# Altium schematic sheet ESP32_MCU.SchDoc: ESP32-WROOM32D Module
size A4; DocumentNumber: 2; SheetNumber: 2; SheetTotal: 31
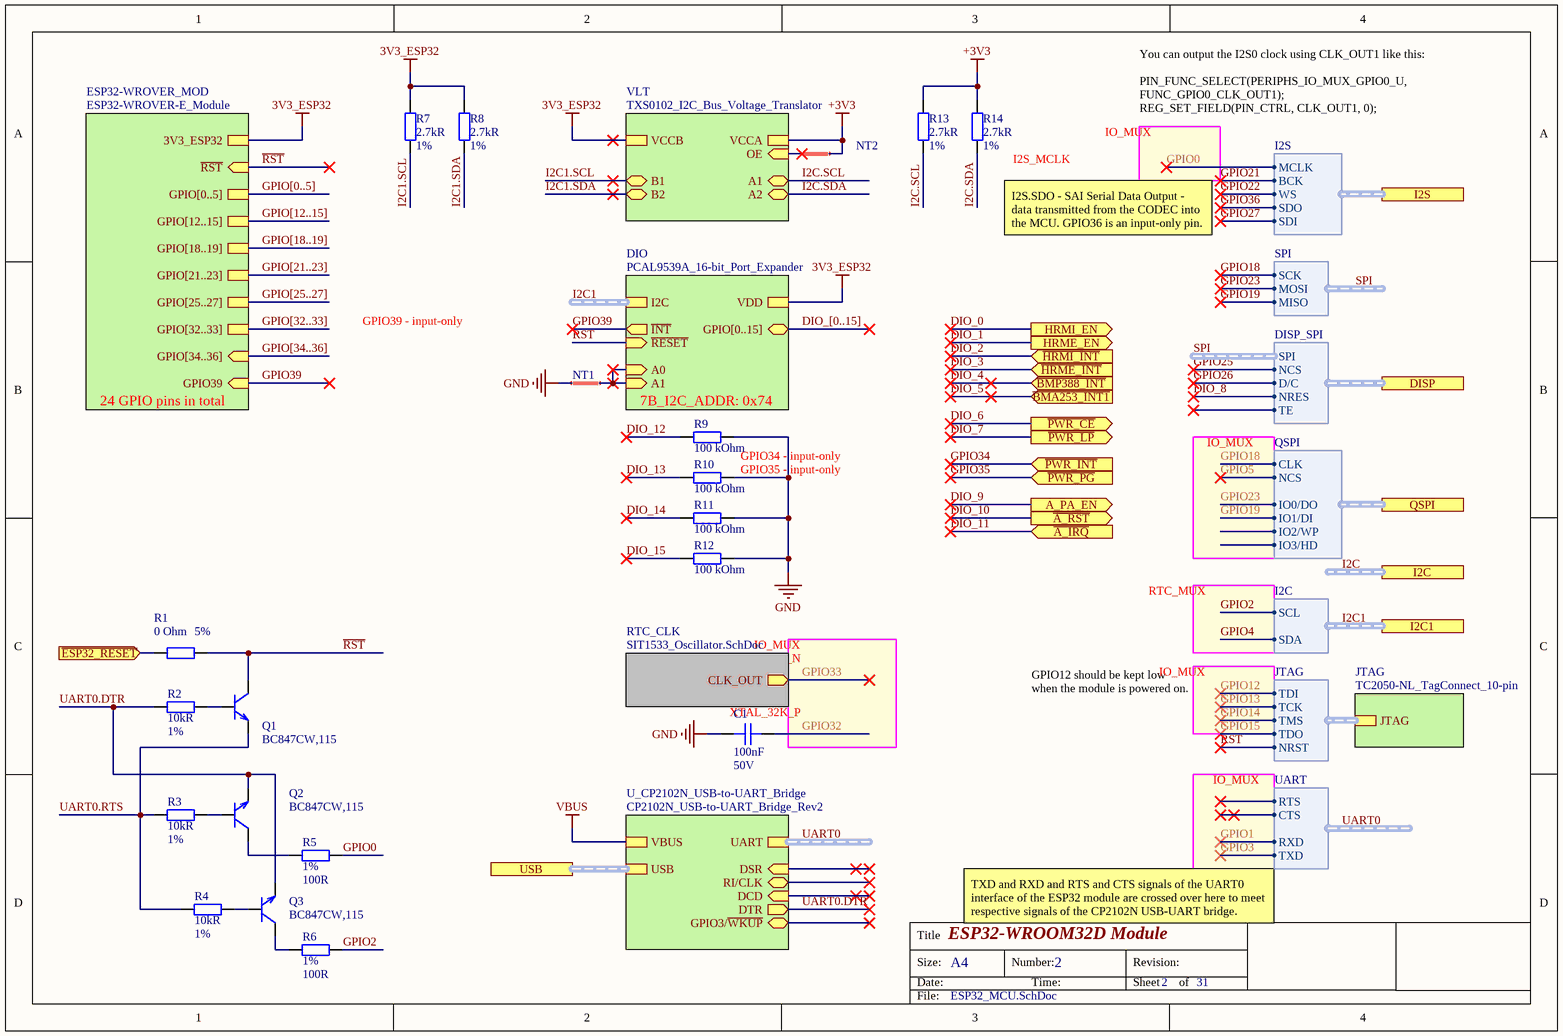
[diagram p0: ESP32_MCU.SchDoc]

## Parts
C1  Capacitance: 100nF  Voltage: 50V  [C0402]  (hidden comment: CAP CER 0.1UF 50V X7R 0402)
NT1  Net Tie  [Net Tie 6x30mil]  (value not drawn)  (net tie, no BOM)
NT2  Net Tie  [Net Tie 6x30mil]  (value not drawn)  (net tie, no BOM)
Q1  BC847CW,115  [SOT-323]
Q2  BC847CW,115  [SOT-323]
Q3  BC847CW,115  [SOT-323]
R1  Tolerance: 5%  Resistance: 0 Ohm  [R0402]  (hidden comment: RES SMD 0 OHM JUMPER 1/16W 0402)
R2  Resistance: 10kR  Tolerance: 1%  [R0402]  (hidden comment: RES SMD 10K OHM 1% 1/16W 0402)
R3  Resistance: 10kR  Tolerance: 1%  [R0402]  (hidden comment: RES SMD 10K OHM 1% 1/16W 0402)
R4  Resistance: 10kR  Tolerance: 1%  [R0402]  (hidden comment: RES SMD 10K OHM 1% 1/16W 0402)
R5  Tolerance: 1%  Resistance: 100R  [0402R]  (hidden comment: RES SMD 100 OHM 1% 1/16W 0402)
R6  Tolerance: 1%  Resistance: 100R  [0402R]  (hidden comment: RES SMD 100 OHM 1% 1/16W 0402)
R7  Resistance: 2.7kR  Tolerance: 1%  [R0402]  (hidden comment: RES SMD 2.7K OHM 1% 1/16W 0402)
R8  Resistance: 2.7kR  Tolerance: 1%  [R0402]  (hidden comment: RES SMD 2.7K OHM 1% 1/16W 0402)
R9  Resistance: 100 kOhm  [0402R]  (hidden comment: RES SMD 100K OHM 1% 1/16W 0402)
R10  Resistance: 100 kOhm  [0402R]  (hidden comment: RES SMD 100K OHM 1% 1/16W 0402)
R11  Resistance: 100 kOhm  [0402R]  (hidden comment: RES SMD 100K OHM 1% 1/16W 0402)
R12  Resistance: 100 kOhm  [0402R]  (hidden comment: RES SMD 100K OHM 1% 1/16W 0402)
R13  Resistance: 2.7kR  Tolerance: 1%  [R0402]  (hidden comment: RES SMD 2.7K OHM 1% 1/16W 0402)
R14  Resistance: 2.7kR  Tolerance: 1%  [R0402]  (hidden comment: RES SMD 2.7K OHM 1% 1/16W 0402)

## Sub-sheets
DIO = PCAL9539A_16-bit_Port_Expander: I2C (harness I2C), ~{RESET} (in), ~{INT} (out), A0 (in), A1 (in), VDD, GPIO[0..15] (bidir)  | 7B_I2C_ADDR: 0x74
ESP32-WROVER_MOD = ESP32-WROVER-E_Module: ~{RST} (in), GPIO[21..23], GPIO[25..27], GPIO[18..19], GPIO[12..15], GPIO39 (in), GPIO[0..5], 3V3_ESP32, GPIO[34..36] (in), GPIO[32..33]  | : 24 GPIO pins in total
JTAG = TC2050-NL_TagConnect_10-pin: JTAG (harness JTAG)  | Caption: JTAG
RTC_CLK = SIT1533_Oscillator.SchDoc: CLK_OUT (out)
U_CP2102N_USB-to-UART_Bridge = CP2102N_USB-to-UART_Bridge_Rev2: GPIO3/~{WKUP} (bidir), UART (harness UART), DCD (in), RI/CLK (bidir), DTR (out), DSR (in), USB (harness USB), VBUS
VLT = TXS0102_I2C_Bus_Voltage_Translator: VCCA, VCCB, OE (in), A1 (bidir), A2 (bidir), B1 (bidir), B2 (bidir)

## Ports
A_PA_EN (out), DISP (harness DISP_SPI), HRME_EN (out), HRMI_EN (out), I2C1 (harness I2C), I2C (harness I2C), I2S (harness I2S), QSPI (harness QSPI), USB (harness USB), ~{A_IRQ} (in), ~{A_RST} (out), ~{BMA253_INT1} (in), ~{BMP388_INT} (in), ~{ESP32_RESET} (in), ~{HRME_INT} (in), ~{HRMI_INT} (in), ~{PWR_CE} (out), ~{PWR_INT} (in), ~{PWR_LP} (out), ~{PWR_PG} (in)

## Harnesses
I2C: SCL, SDA
UART: RTS, CTS, RXD, TXD
I2S: WS, SDI, BCK, SDO, MCLK
QSPI: IO0/DO, IO1/DI, NCS, CLK, IO2/WP, IO3/HD
JTAG: TDI, TMS, TCK, TDO, NRST
DISP_SPI: SPI, NCS, D/C, NRES, TE
SPI: SCK, MISO, MOSI

## Nets
3V3_ESP32: R7.2 R8.2 ; sheet ESP32-WROVER_MOD/3V3_ESP32, sheet DIO/VDD, sheet VLT/VCCB
+3V3: NT2.2 R13.2 R14.2 ; sheet VLT/VCCA
GND: C1.2 NT1.1 R9.2 R10.2 R11.2 R12.2
VBUS: sheet U_CP2102N_USB-to-UART_Bridge/VBUS
~{ESP32_RESET}: R1.1 ; port ~{ESP32_RESET}
~{RST}: Q1.3(C) R1.2 ; sheet ESP32-WROVER_MOD/~{RST}, sheet DIO/~{RESET}, sheet JTAG/JTAG.NRST
DIO_0: port HRMI_EN
DIO_1: port HRME_EN
DIO_2: port ~{HRMI_INT}
DIO_3: port ~{HRME_INT}
DIO_4: port ~{BMP388_INT}
DIO_5: port ~{BMA253_INT1}
DIO_6: port ~{PWR_CE}
DIO_7: port ~{PWR_LP}
DIO_8: port DISP.NRES
DIO_9: port A_PA_EN
DIO_10: port ~{A_RST}
DIO_11: port ~{A_IRQ}
DIO_12: R9.1
DIO_13: R10.1
DIO_14: R11.1
DIO_15: R12.1
GPIO0: R5.1 ; port I2S.MCLK
GPIO1: sheet U_CP2102N_USB-to-UART_Bridge/UART.RXD
GPIO2: R6.1 ; port I2C1.SCL
GPIO3: sheet U_CP2102N_USB-to-UART_Bridge/UART.TXD
GPIO4: port I2C1.SDA
GPIO5: port QSPI.NCS
GPIO12: sheet JTAG/JTAG.TDI
GPIO13: sheet JTAG/JTAG.TCK
GPIO14: sheet JTAG/JTAG.TMS
GPIO15: sheet JTAG/JTAG.TDO
GPIO18: port QSPI.CLK, harness SPI.SCK
GPIO19: port QSPI.IO1/DI, harness SPI.MISO
GPIO21: port I2S.BCK
GPIO22: port I2S.WS
GPIO23: port QSPI.IO0/DO, harness SPI.MOSI
GPIO25: port DISP.NCS
GPIO26: port DISP.D/C
GPIO27: port I2S.SDI
GPIO32: C1.1
GPIO33: sheet RTC_CLK/CLK_OUT
GPIO34: port ~{PWR_INT}
GPIO35: port ~{PWR_PG}
GPIO36: port I2S.SDO
GPIO39: sheet ESP32-WROVER_MOD/GPIO39, sheet DIO/~{INT}
I2C1.SCL: R7.1 ; sheet VLT/B1
I2C1.SDA: R8.1 ; sheet VLT/B2
I2C.SCL: R13.1 ; sheet VLT/A1
I2C.SDA: R14.1 ; sheet VLT/A2
UART0.DTR: Q2.2(E) Q3.2(E) R2.1 ; sheet U_CP2102N_USB-to-UART_Bridge/DTR
UART0.RTS: Q1.2(E) R3.1 R4.1
NetNT1_2: NT1.2 ; sheet DIO/A0, sheet DIO/A1
NetNT2_1: NT2.1 ; sheet VLT/OE
NetQ1_1: Q1.1(B) R2.2
NetQ2_1: Q2.1(B) R3.2
NetQ2_3: Q2.3(C) R5.2
NetQ3_1: Q3.1(B) R4.2
NetQ3_3: Q3.3(C) R6.2

## Buses and harness runs
bus DIO_[0..15] = sheet DIO/GPIO[0..15]
bus GPIO[0..5] = sheet ESP32-WROVER_MOD/GPIO[0..5]
bus GPIO[12..15] = sheet ESP32-WROVER_MOD/GPIO[12..15]
bus GPIO[18..19] = sheet ESP32-WROVER_MOD/GPIO[18..19]
bus GPIO[21..23] = sheet ESP32-WROVER_MOD/GPIO[21..23]
bus GPIO[25..27] = sheet ESP32-WROVER_MOD/GPIO[25..27]
bus GPIO[32..33] = sheet ESP32-WROVER_MOD/GPIO[32..33]
bus GPIO[34..36] = sheet ESP32-WROVER_MOD/GPIO[34..36]
harness I2C1 = port I2C1
harness I2C1 = sheet DIO/I2C
harness I2C = port I2C
harness port USB = sheet U_CP2102N_USB-to-UART_Bridge/USB
harness UART0 = sheet U_CP2102N_USB-to-UART_Bridge/UART

## Notes on the sheet
- I2S_MCLK
- You can output the I2S0 clock using CLK_OUT1 like this:
  PIN_FUNC_SELECT(PERIPHS_IO_MUX_GPIO0_U, FUNC_GPIO0_CLK_OUT1);
  REG_SET_FIELD(PIN_CTRL, CLK_OUT1, 0);
- IO_MUX
- (near R14) I2S.SDO - SAI Serial Data Output - data transmitted from the CODEC into the MCU. GPIO36 is an input-only pin.
- GPIO39 - input-only
- GPIO34 - input-only
- GPIO35 - input-only
- RTC_MUX
- (near C1) XTAL_32K_P
- XTAL_32K_N
- GPIO12 should be kept low when the module is powered on.
- TXD and RXD and RTS and CTS signals of the UART0 interface of the ESP32 module are crossed over here to meet respective signals of the CP2102N USB-UART bridge.
- Title
- Size:
- Date:
- A4
- Number:
- Time:
- Revision:
- Sheet
- of
- File:

## Library data of the parts
C1 = CAP CER 0.1UF 50V X7R 0402: 0.1µF ±10% 50V Ceramic Capacitor X7R 0402 (1005 Metric); Manufacturer: TDK; Manufacturer Part Number: CGA2B3X7R1H104K050BB; Supplier 1: Digi-Key; Stock 1: 2925303; Pricing 1: 1=0.17, 10=0.118, 50=0.0668, 100=0.0553, 500=0.0388, 1000=0.0321, 2500=0.0299, 5000=0.0273 (USD); Mount: Surface Mount; Case/Package: 0402; Weight: 2.3E-05oz; Case Code (Metric): 1005; Case Code (Imperial): 0402; Min Operating Temperature: -55°C; Max Operating Temperature: 125°C; Voltage Rating: 50V; Tolerance: 10%; Packaging: Tape and Reel; Package Quantity: 1; Voltage Rating (DC): 50V; Dielectric: X7R; Termination: SMD/SMT; Composition: Ceramic; Length: 1mm; Height: 0.5mm; Width: 0.02inch; Thickness: 0.022inch; Depth: 0.5mm; Ratings: AEC-Q200; REACH SVHC: No SVHC; Lead Free: Lead Free; ComponentLink1URL: http://product.tdk.com/capacitor/mlcc/en/documents/mlccspec_automotive_general_midvoltage_en.pdf?src-supplier=Future+Electronics; ComponentLink1Description: http://product.tdk.com/capacitor/mlcc/en/documents/mlccspec_automotive_general_midvoltage_en.pdf?src-supplier=Future+Electronics; ComponentLink2URL: http://www.farnell.com/datasheets/1807242.pdf?src-supplier=Element14; ComponentLink2Description: http://www.farnell.com/datasheets/1807242.pdf?src-supplier=Element14; ComponentLink3URL: http://www.mouser.com/ds/2/400/lcc_automotive_general_en-843974.pdf?src-supplier=Mouser; ComponentLink3Description: http://www.mouser.com/ds/2/400/lcc_automotive_general_en-843974.pdf?src-supplier=Mouser; ComponentLink4URL: http://www.farnell.com/datasheets/1936565.pdf?src-supplier=Element14; ComponentLink4Description: http://www.farnell.com/datasheets/1936565.pdf?src-supplier=Element14; ComponentLink5URL: http://www.farnell.com/datasheets/1735392.pdf?src-supplier=Element14; ComponentLink5Description: http://www.farnell.com/datasheets/1735392.pdf?src-supplier=Element14; Supplier Part Number 1: 445-6899-1-ND
NT1 NT2 = Net Tie Line: ClassName: Net Tie
Q1-Q3 = TRANS BC847CW,115 NPN 45V 0.1A SOT323: Bipolar (BJT) Transistor NPN 45V 100mA 100MHz 200mW Surface Mount SOT-323-3; Manufacturer: Nexperia; Supplier 1: Digi-Key; Manufacturer Part Number: BC847CW,115; Stock 1: 327256; Pricing 1: 1=0.13, 10=0.118, 25=0.1124, 100=0.0495, 250=0.0475, 500=0.0389, 1000=0.027 (USD); ComponentLink1URL: http://www.farnell.com/datasheets/1856333.pdf?src-supplier=Farnell; ComponentLink1Description: http://www.farnell.com/datasheets/1856333.pdf?src-supplier=Farnell; ComponentLink2URL: http://www.farnell.com/datasheets/1856333.pdf?src-supplier=Element14; ComponentLink2Description: http://www.farnell.com/datasheets/1856333.pdf?src-supplier=Element14; ComponentLink3URL: https://assets.nexperia.com/documents/data-sheet/BC847_SER.pdf?src-supplier=Digi-Key; ComponentLink3Description: https://assets.nexperia.com/documents/data-sheet/BC847_SER.pdf?src-supplier=Digi-Key; ComponentLink4URL: http://www.farnell.com/datasheets/1856333.pdf?src-supplier=Newark; ComponentLink4Description: http://www.farnell.com/datasheets/1856333.pdf?src-supplier=Newark; Supplier Part Number 1: 1727-4312-1-ND; ClassName: U_ESP32-WROOM32D_Module; Mount: Surface Mount
R1 = RES SMD 0 OHM JUMPER 1/16W 0402: 0 Ohms Jumper 0.063W, 1/16W Chip Resistor 0402 (1005 Metric) Moisture Resistant Thick Film; Manufacturer: Yageo; Manufacturer Part Number: RC0402JR-070RL; Power Rating: 62.5mW; Voltage Rating: 50V; Max Power Dissipation: 63mW; Temperature Coefficient: 200ppm/°C; Supplier 1: Digi-Key; Stock 1: 46057148; Pricing 1: 1=0.1, 10=0.013, 25=0.0092, 50=0.0072, 100=0.0053, 250=0.004, 500=0.0032, 1000=0.0024, 5000=0.0017 (USD); Contact Plating: Tin,Matte; Case Code (Metric): 1005; Case Code (Imperial): 0402; Min Operating Temperature: -55°C; Max Operating Temperature: 155°C; Packaging: Tape and Reel; Composition: Thick Film; Package Quantity: 1; Number of Terminations: 2; Termination: SMD/SMT; Military Standard: Not; Features: Moisture Resistant; Length: 1mm; Height: 0.016inch; Width: 0.02inch; Depth: 0.5mm; Radiation Hardening: No; REACH SVHC: Unknown; Lead Free: Lead Free; ComponentLink1URL: http://www.yageo.com/documents/recent/PYu-RC_Group_51_RoHS_L_10.pdf?src-supplier=Digi-Key; ComponentLink1Description: http://www.yageo.com/documents/recent/PYu-RC_Group_51_RoHS_L_10.pdf?src-supplier=Digi-Key; ComponentLink2URL: http://www.yageo.com/documents/recent/PYu-RC0402_51_RoHS_L_6.pdf?src-supplier=Avnet+Europe; ComponentLink2Description: http://www.yageo.com/documents/recent/PYu-RC0402_51_RoHS_L_6.pdf?src-supplier=Avnet+Europe; ComponentLink3URL: http://www.farnell.com/datasheets/1018594.pdf?src-supplier=Element14; ComponentLink3Description: http://www.farnell.com/datasheets/1018594.pdf?src-supplier=Element14; ComponentLink4URL: https://www.verical.com/server-webapp/html/getDatasheet?partID=326379&src-supplier=Verical; ComponentLink4Description: https://www.verical.com/server-webapp/html/getDatasheet?partID=326379&src-supplier=Verical; ComponentLink5URL: http://www.farnell.com/datasheets/2167052.pdf?src-supplier=Element14; ComponentLink5Description: http://www.farnell.com/datasheets/2167052.pdf?src-supplier=Element14; Supplier Part Number 1: 311-0.0JRCT-ND; Case/Package: 0402; ClassName: U_ESP32-WROOM32D_Module; Mount: Surface Mount
R2-R4 = RES SMD 10K OHM 1% 1/16W 0402: 10 kOhms ±1% 0.063W, 1/16W Chip Resistor 0402 (1005 Metric) Moisture Resistant Thick Film; Manufacturer Part Number: RC0402FR-0710KP; Manufacturer: Yageo; Temperature Coefficient: 150ppm/°C; Max Power Dissipation: 63mW; Supplier 1: Digi-Key; Stock 1: 839368; Pricing 1: 1=0.1, 10=0.035, 100=0.014, 1000=0.0063, 2500=0.0055, 5000=0.0045 (USD); Case Code (Imperial): 0402; Case Code (Metric): 1005; Min Operating Temperature: -55°C; Max Operating Temperature: 155°C; Composition: Thick Film; Packaging: Tape and Reel; Number of Terminations: 2; Length: 0.039inch; Height: 0.016inch; Width: 0.02inch; ComponentLink1URL: http://www.yageo.com/NewPortal/yageodocoutput?fileName=/pdf/R-Chip/PYu-RC_51_RoHS_P_0.pdf&src-supplier=Digi-Key; ComponentLink1Description: http://www.yageo.com/NewPortal/yageodocoutput?fileName=/pdf/R-Chip/PYu-RC_51_RoHS_P_0.pdf&src-supplier=Digi-Key; Supplier Part Number 1: YAG1249CT-ND; Case/Package: 0402; Features: Moisture Resistant; ClassName: U_ESP32-WROOM32D_Module; Mount: Surface Mount
R5 R6 = RES SMD 100 OHM 1% 1/16W 0402: 100 Ohms ±1% 0.063W, 1/16W Chip Resistor 0402 (1005 Metric) Moisture Resistant Thick Film; Manufacturer: Yageo; Manufacturer Part Number: RC0402FR-07100RL; Power Rating: 62.5mW; Voltage Rating: 50V; Temperature Coefficient: 100ppm/°C; Supplier 1: Digi-Key; Stock 1: 16989760; Pricing 1: 1=0.1, 10=0.016, 100=0.0064, 1000=0.0029, 2500=0.0025, 5000=0.0021 (USD); Case Code (Metric): 1005; Case Code (Imperial): 0402; Min Operating Temperature: -55°C; Max Operating Temperature: 155°C; Packaging: Tape and Reel; Composition: Thick Film; Termination: SMD/SMT; Military Standard: Not; Length: 1mm; Height: 0.32mm; Width: 0.5mm; Depth: 0.5mm; REACH SVHC: No SVHC; Lead Free: Lead Free; ComponentLink1URL: http://www.farnell.com/datasheets/2167052.pdf?src-supplier=Element14; ComponentLink1Description: http://www.farnell.com/datasheets/2167052.pdf?src-supplier=Element14; ComponentLink2URL: http://www.yageo.com/documents/recent/PYu-RC_Group_51_RoHS_L_9.pdf?src-supplier=Mouser; ComponentLink2Description: http://www.yageo.com/documents/recent/PYu-RC_Group_51_RoHS_L_9.pdf?src-supplier=Mouser; ComponentLink3URL: http://www.yageo.com/documents/recent/PYu-RC0402_51_RoHS_L_6_r.pdf?src-supplier=Future+Electronics; ComponentLink3Description: http://www.yageo.com/documents/recent/PYu-RC0402_51_RoHS_L_6_r.pdf?src-supplier=Future+Electronics; ComponentLink4URL: https://www.verical.com/server-webapp/html/getDatasheet?partID=329466&src-supplier=Verical; ComponentLink4Description: https://www.verical.com/server-webapp/html/getDatasheet?partID=329466&src-supplier=Verical; ComponentLink5URL: http://www.farnell.com/datasheets/1018594.pdf?src-supplier=Element14; ComponentLink5Description: http://www.farnell.com/datasheets/1018594.pdf?src-supplier=Element14; Supplier Part Number 1: 311-100LRDKR-ND; Case/Package: 0402; Number of Pins: 2; Voltage Rating (DC): 50V; ComponentLink6URL: http://documents.rs-components.com/techlib://itc_doclist_GB.htm?stockno=6185810&src-supplier=RSComponents; ComponentLink6Description: http://documents.rs-components.com/techlib://itc_doclist_GB.htm?stockno=6185810&src-supplier=RSComponents
R7 R8 R13 R14 = RES SMD 2.7K OHM 1% 1/16W 0402: 2.7 kOhms ±1% 0.063W, 1/16W Chip Resistor 0402 (1005 Metric) Moisture Resistant Thick Film; Manufacturer Part Number: RC0402FR-072K7L; Manufacturer: Yageo; Temperature Coefficient: 100ppm/°C; Voltage Rating: 50V; Power Rating: 63mW; Supplier 1: Digi-Key; Stock 1: 261850; Pricing 1: 1=0.1, 10=0.016, 100=0.0064, 1000=0.0029, 2500=0.0025, 5000=0.0021 (USD); Case Code (Imperial): 0402; Case Code (Metric): 1005; Min Operating Temperature: -55°C; Max Operating Temperature: 155°C; Composition: Thick Film; Packaging: Tape and Reel; Termination: SMD/SMT; Military Standard: Not; Working Voltage: 50V; Number of Terminations: 2; Length: 1mm; Height: 0.016inch; Width: 0.02inch; Depth: 0.5mm; REACH SVHC: Unknown; Lead Free: Lead Free; ComponentLink1URL: http://www.mouser.com/ds/2/447/PYu-RC0402_51_RoHS_L_6_r-8721.pdf?src-supplier=Mouser; ComponentLink1Description: http://www.mouser.com/ds/2/447/PYu-RC0402_51_RoHS_L_6_r-8721.pdf?src-supplier=Mouser; ComponentLink2URL: http://www.yageo.com/documents/recent/PYu-RC_Group_51_RoHS_L_9.pdf?src-supplier=Digi-Key; ComponentLink2Description: http://www.yageo.com/documents/recent/PYu-RC_Group_51_RoHS_L_9.pdf?src-supplier=Digi-Key; ComponentLink3URL: http://www.yageo.com/documents/recent/PYu-RC_Group_51_RoHS_L_10.pdf?src-supplier=Digi-Key; ComponentLink3Description: http://www.yageo.com/documents/recent/PYu-RC_Group_51_RoHS_L_10.pdf?src-supplier=Digi-Key; ComponentLink4URL: http://www.farnell.com/datasheets/2167052.pdf?src-supplier=Element14; ComponentLink4Description: http://www.farnell.com/datasheets/2167052.pdf?src-supplier=Element14; Supplier Part Number 1: 311-2.70KLRCT-ND; Case/Package: 0402; Package Quantity: 1; Max Power Dissipation: 63mW; Features: Moisture Resistant; ClassName: U_ESP32-WROOM32D_Module
R9-R12 = RES SMD 100K OHM 1% 1/16W 0402: 100 kOhms ±1% 0.063W, 1/16W Chip Resistor 0402 (1005 Metric) Moisture Resistant Thick Film; Manufacturer: Yageo; Manufacturer Part Number: RC0402FR-07100KL; Temperature Coefficient: 100ppm/°C; Power Rating: 63mW; Voltage Rating: 50V; Supplier 1: Digi-Key; Stock 1: 47448883; Pricing 1: 1=0.1, 10=0.016, 100=0.0064, 1000=0.0029, 2500=0.0025, 5000=0.0021 (USD); Case Code (Metric): 1005; Case Code (Imperial): 0402; Min Operating Temperature: -55°C; Max Operating Temperature: 155°C; Composition: Thick Film; Packaging: Tape and Reel; Package Quantity: 1; Number of Terminations: 2; Termination: SMD/SMT; Military Standard: Not; Max Power Dissipation: 63mW; Working Voltage: 50V; Features: Moisture Resistant; Length: 0.039inch; Height: 0.016inch; Width: 0.02inch; Depth: 0.5mm; REACH SVHC: No SVHC; Lead Free: Lead Free; ComponentLink1URL: http://www.yageo.com/documents/recent/PYu-RC_Group_51_RoHS_L_10.pdf?src-supplier=Digi-Key; ComponentLink1Description: http://www.yageo.com/documents/recent/PYu-RC_Group_51_RoHS_L_10.pdf?src-supplier=Digi-Key; ComponentLink2URL: http://www.farnell.com/datasheets/1018594.pdf?src-supplier=Element14; ComponentLink2Description: http://www.farnell.com/datasheets/1018594.pdf?src-supplier=Element14; ComponentLink3URL: http://www.yageo.com/documents/recent/PYu-RC_Group_51_RoHS_L_9.pdf?src-supplier=Verical; ComponentLink3Description: http://www.yageo.com/documents/recent/PYu-RC_Group_51_RoHS_L_9.pdf?src-supplier=Verical; ComponentLink4URL: http://www.yageo.com/documents/recent/PYu-RC_Group_51_RoHS_L_9.pdf?src-supplier=Mouser; ComponentLink4Description: http://www.yageo.com/documents/recent/PYu-RC_Group_51_RoHS_L_9.pdf?src-supplier=Mouser; ComponentLink5URL: http://documents.rs-components.com/techlib://itc_doclist_GB.htm?stockno=6185797&src-supplier=RSComponents; ComponentLink5Description: http://documents.rs-components.com/techlib://itc_doclist_GB.htm?stockno=6185797&src-supplier=RSComponents; Supplier Part Number 1: 311-100KLRDKR-ND; Case/Package: 0402; Tolerance: 1%